# Altium schematic sheet DAC.SchDoc: My title
size A3; Organization: University of California; Address1: 475 Portola Plaza; Address2: Los Angeles, CA 90095; Revision: R01; SheetNumber: 1; SheetTotal: 1
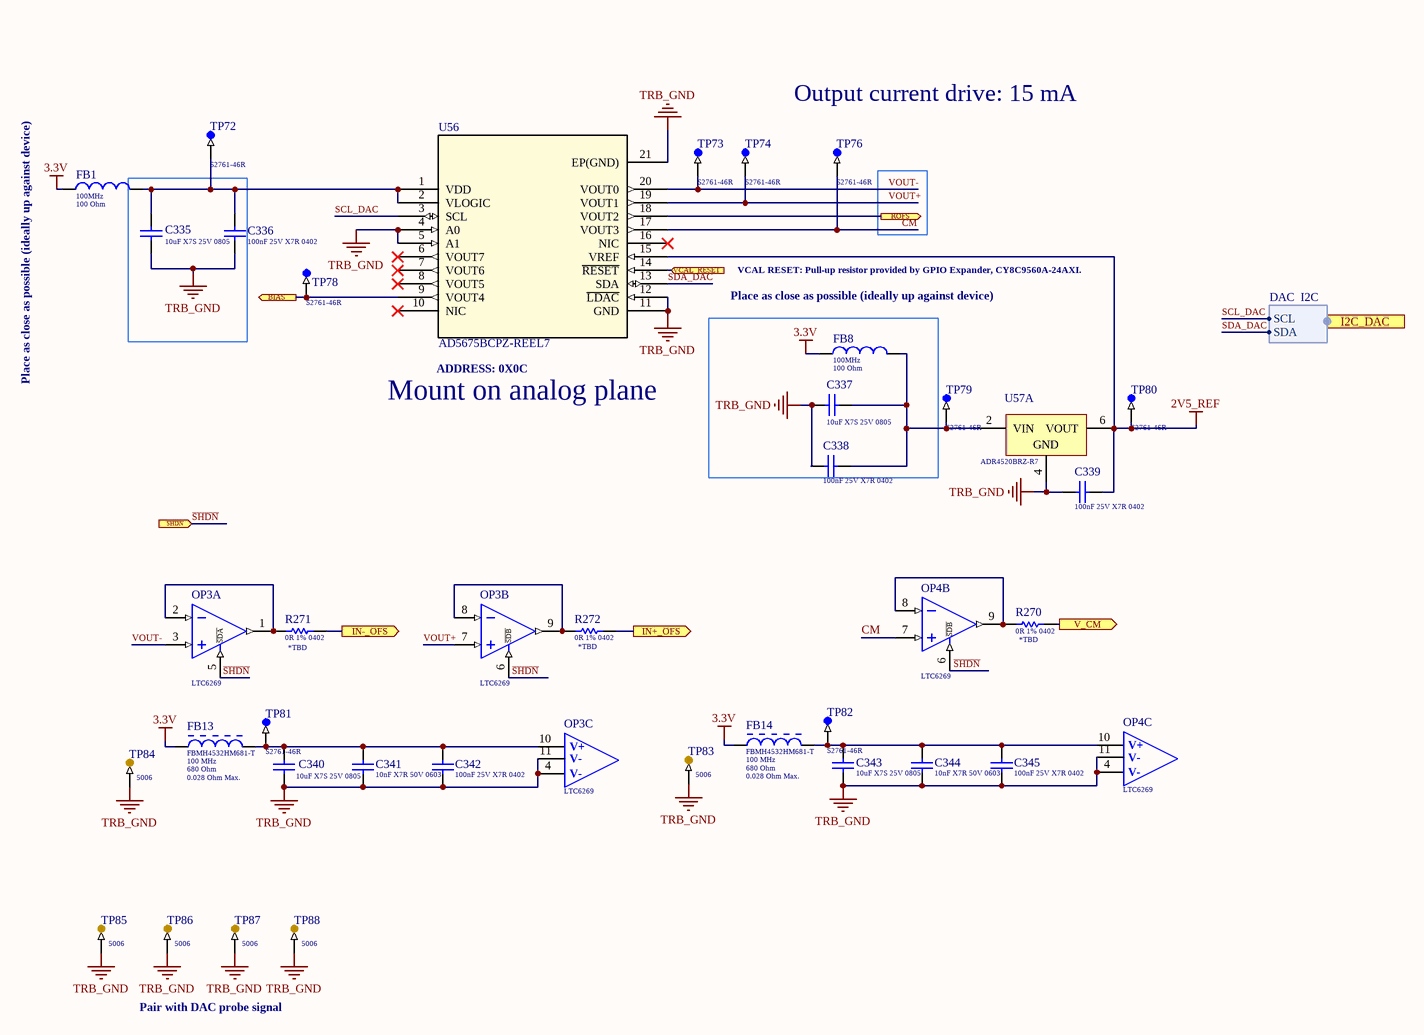
[diagram p0: DAC.SchDoc]

## Parts
C335  Capacitance: 10uF X7S 25V 0805  [Cap_Murata_ GRM21BC71E106ME11L_10uF]  (hidden comment: Cap_Murata_ GRM21BC71E106ME11L_10uF)
C336  Capacitance: 100nF 25V X7R 0402  [Cap_Taiyo_Yuden_TMK105B7104KV-FR_100nF]  (hidden comment: Cap_Taiyo_Yuden_TMK105B7104KV-FR_100nF)
C337  Capacitance: 10uF X7S 25V 0805  [Cap_Murata_ GRM21BC71E106ME11L_10uF]  (hidden comment: Cap_Murata_ GRM21BC71E106ME11L_10uF)
C338  Capacitance: 100nF 25V X7R 0402  [Cap_Taiyo_Yuden_TMK105B7104KV-FR_100nF]  (hidden comment: Cap_Taiyo_Yuden_TMK105B7104KV-FR_100nF)
C339  Capacitance: 100nF 25V X7R 0402  [Cap_Taiyo_Yuden_TMK105B7104KV-FR_100nF]  (hidden comment: Cap_Taiyo_Yuden_TMK105B7104KV-FR_100nF)
C340  Capacitance: 10uF X7S 25V 0805  [Cap_Murata_ GRM21BC71E106ME11L_10uF]  (hidden comment: Cap_Murata_ GRM21BC71E106ME11L_10uF)
C341  Capacitance: 10nF X7R 50V 0603  [Kemet_C0603_0]  (hidden comment: Cap_Kemet_C0603C103J5RACTU_eec)
C342  Capacitance: 100nF 25V X7R 0402  [Cap_Taiyo_Yuden_TMK105B7104KV-FR_100nF]  (hidden comment: Cap_Taiyo_Yuden_TMK105B7104KV-FR_100nF)
C343  Capacitance: 10uF X7S 25V 0805  [Cap_Murata_ GRM21BC71E106ME11L_10uF]  (hidden comment: Cap_Murata_ GRM21BC71E106ME11L_10uF)
C344  Capacitance: 10nF X7R 50V 0603  [Kemet_C0603_0]  (hidden comment: Cap_Kemet_C0603C103J5RACTU_eec)
C345  Capacitance: 100nF 25V X7R 0402  [Cap_Taiyo_Yuden_TMK105B7104KV-FR_100nF]  (hidden comment: Cap_Taiyo_Yuden_TMK105B7104KV-FR_100nF)
FB1  Measuring Frequency: 100MHz  Impedance: 100 Ohm  [FB_Wurth_Electronics_742792731_100Ohms]  (hidden comment: 742792731)
FB8  Measuring Frequency: 100MHz  Impedance: 100 Ohm  [FB_Wurth_Electronics_742792731_100Ohms]  (hidden comment: 742792731)
FB13  Measuring Frequency: 100 MHz  Nominal Impedance: 680 Ohm  DC Resistance: 0.028 Ohm Max.  [TAYO-FBMH4532-2_V]  (hidden comment: FBMH4532HM681-T)
FB14  Measuring Frequency: 100 MHz  Nominal Impedance: 680 Ohm  DC Resistance: 0.028 Ohm Max.  [TAYO-FBMH4532-2_V]  (hidden comment: FBMH4532HM681-T)
OP3  Series: LTC6269  [OpAmp_Linear_Technology_ LTC6269HDD#PBF_500Mhz]  (hidden comment: OpAmp_Linear_Technology_ LTC6269HDD#PBF_500Mhz)  (parts A,B,C of 3)
OP4  Series: LTC6269  [OpAmp_Linear_Technology_ LTC6269HDD#PBF_500Mhz]  (hidden comment: OpAmp_Linear_Technology_ LTC6269HDD#PBF_500Mhz)  (parts B,C of 3)
R270  Resistance: 0R 1% 0402  [Res_Vishay_CRCW04020000Z0EDC_0_Ohm]  (hidden comment: Res_Vishay_CRCW04020000Z0EDC_0_Ohm)
R271  Resistance: 0R 1% 0402  [Res_Vishay_CRCW04020000Z0EDC_0_Ohm]  (hidden comment: Res_Vishay_CRCW04020000Z0EDC_0_Ohm)
R272  Resistance: 0R 1% 0402  [Res_Vishay_CRCW04020000Z0EDC_0_Ohm]  (hidden comment: Res_Vishay_CRCW04020000Z0EDC_0_Ohm)
TP72  Series: S2761-46R  [TP_Harwin_S2761_46R]  (hidden comment: TP_Harwin_S2761_46R)
TP73  Series: S2761-46R  [TP_Harwin_S2761_46R]  (hidden comment: TP_Harwin_S2761_46R)
TP74  Series: S2761-46R  [TP_Harwin_S2761_46R]  (hidden comment: TP_Harwin_S2761_46R)
TP76  Series: S2761-46R  [TP_Harwin_S2761_46R]  (hidden comment: TP_Harwin_S2761_46R)
TP78  Series: S2761-46R  [TP_Harwin_S2761_46R]  (hidden comment: TP_Harwin_S2761_46R)
TP79  Series: S2761-46R  [TP_Harwin_S2761_46R]  (hidden comment: TP_Harwin_S2761_46R)
TP80  Series: S2761-46R  [TP_Harwin_S2761_46R]  (hidden comment: TP_Harwin_S2761_46R)
TP81  Series: S2761-46R  [TP_Harwin_S2761_46R]  (hidden comment: TP_Harwin_S2761_46R)
TP82  Series: S2761-46R  [TP_Harwin_S2761_46R]  (hidden comment: TP_Harwin_S2761_46R)
TP83  Series: 5006  [TP_Keystone_Electronics_5006]  (hidden comment: TP_Keystone_Electronics_5006)
TP84  Series: 5006  [TP_Keystone_Electronics_5006]  (hidden comment: TP_Keystone_Electronics_5006)
TP85  Series: 5006  [TP_Keystone_Electronics_5006]  (hidden comment: TP_Keystone_Electronics_5006)
TP86  Series: 5006  [TP_Keystone_Electronics_5006]  (hidden comment: TP_Keystone_Electronics_5006)
TP87  Series: 5006  [TP_Keystone_Electronics_5006]  (hidden comment: TP_Keystone_Electronics_5006)
TP88  Series: 5006  [TP_Keystone_Electronics_5006]  (hidden comment: TP_Keystone_Electronics_5006)
U56  AD5675  [CP_20_8]  (value not drawn)
U57  ADR4520BRZ-R7  [ADI-R-8_M]  (part A of 2)

## Blocks framed on the sheet
Place as close as possible (ideally up against device): C337 C338 FB8

## Ports
BIAS (out), I2C_DAC (harness DAC  I2C), IN+_OFS (out), IN-_OFS (out), ROFS (out), V_CM (out), VCAL_RESET (in), ~{SHDN} (in)

## Harnesses
DAC  I2C: SCL, SDA

## Nets
2V5_REF: C339.2 TP80.1 U56.15(VREF) U57.6(VOUT)
3.3V: FB1.1 FB8.1 FB13.1 FB14.1
TRB_GND: C335.2 C336.1 C337.2 C338.1 C339.1 C340.2 C341.2 C342.1 C343.2 C344.2 C345.1 OP3.4(V-) OP3.11(V-) OP4.4(V-) OP4.11(V-) TP83.1 TP84.1 TP85.1 TP86.1 TP87.1 TP88.1 U56.4(A0) U56.5(A1) U56.11(GND) U56.12(~{LDAC}) U56.21(EP(GND)) U57.4(GND)
BIAS: TP78.1 U56.9(VOUT4) ; port BIAS
CM: OP4.7(IN_A+) TP76.1 U56.17(VOUT3)
IN+_OFS: R272.2 ; port IN+_OFS
IN-_OFS: R271.2 ; port IN-_OFS
ROFS: U56.18(VOUT2) ; port ROFS
~{SHDN}: OP3.5(~{SDA}) OP3.6(~{SDB}) OP4.6(~{SDB}) ; port ~{SHDN}
SCL_DAC: U56.3(SCL) ; port I2C_DAC.SCL
SDA_DAC: U56.13(SDA) ; port I2C_DAC.SDA
V_CM: R270.2 ; port V_CM
VCAL_RESET: U56.14(~{RESET}) ; port VCAL_RESET
VOUT+: OP3.7(IN_A+) TP74.1 U56.19(VOUT1)
VOUT-: OP3.3(IN_A+) TP73.1 U56.20(VOUT0)
NetC335_1: C335.1 C336.2 FB1.2 TP72.1 U56.1(VDD) U56.2(VLOGIC)
NetC337_1: C337.1 C338.2 FB8.2 TP79.1 U57.2(VIN)
NetC340_1: C340.1 C341.1 C342.2 FB13.2 OP3.10(V+) TP81.1
NetC343_1: C343.1 C344.1 C345.2 FB14.2 OP4.10(V+) TP82.1
NetOP3_1: OP3.1(OUT_A) OP3.2(IN_A-) R271.1
NetOP3_8: OP3.8(IN_A-) OP3.9(OUT_A) R272.1
NetOP4_8: OP4.8(IN_A-) OP4.9(OUT_A) R270.1

Not connected (* = marked no-connect by the designer): U56 6(VOUT7)* 7(VOUT6)* 8(VOUT5)* 10(NIC)* 16(NIC)*

## Notes on the sheet
- Output current drive: 15 mA
- VCAL RESET: Pull-up resistor provided by GPIO Expander, CY8C9560A-24AXI.
- (near FB1) Place as close as possible (ideally up against device)
- Mount on analog plane
- (near U56) ADDRESS: 0X0C
- (near R271) *TBD
- (near R272) *TBD
- (near R270) *TBD
- Pair with DAC probe signal
- 475 Portola Plaza
- GAPS TOF
- igarcia91@g.ucla.edu
- Los Angeles, CA
- 310-825-0344
- Size:
- Date:
- Letter
- Number:
- Time:
- Sheet
- Revision:
- of
- andrew.peck@cern.ch
- spq@ucla.edu
- File:

## Library data of the parts
C335 C337 C340 C343 = Cap_Murata_ GRM21BC71E106ME11L_10uF: CAP CER 10uF 25V X7R 0805; Supplier 1: Mouser; Supplier Part Number 1: 81-GRM21BC71E106ME1L
C336 C338 C339 C342 C345 = Cap_Taiyo_Yuden_TMK105B7104KV-FR_100nF: CAP CER 100nF 25V X7R 0402; Supplier 1: Mouser; Supplier Part Number 1: 963-TMK105B7104KV-FR
C341 C344 = Cap_Kemet_C0603C103J5RACTU_eec: CAP CER 10nF 50V X7R 0603; Manufacturer: Kemet; Mfg Package Ident: C0603; Part Number: C0603C103J5RACTU; helpURL: https://upverter.com/upn/revision/8a8d0c297e33ac74/; ComponentLink2Description: Datasheet; Temperature: -55°C to +125°C; Package: C0603; Supplier 2: Mouser; Price: 0.0184203126773; Supplier 1: Digi-Key; ComponentLink1URL: https://upverter.com/upn/revision/8a8d0c297e33ac74/; Supplier Part Number 2: 80-C0603C103J5R; Supplier Part Number 1: 399-1092-1-ND; Value: 10nF; ComponentLink1Description: Upverter; ComponentLink2URL: https://content.kemet.com/datasheets/KEM_C1002_X7R_SMD.pdf; RoHS: TRUE; Mouser Part Number: 80-C0603C103J5R; Temperature Range High: +125°C; Digikey Description: CAP CER 10000PF 50V X7R 0603; Digikey Part Number: 399-1092-1-ND; Lead Free: yes; Temperature Range Low: -55°C; Voltage: 50V
FB1 FB8 = FB_Wurth_Electronics_742792731_100Ohms: FB SMD 100 OHM 25% 1.2A 0402; DC Resistance: 90mOhm; Supplier 1: Mouser; Supplier Part Number 1: 710-742792731
FB13 FB14 = FBMH4532HM681-T: Chip Bead Inductor for Power Lines, 680 Ohm, 4 A, -40 to 125 degC, 2-Pin 4.5 x 3.2 x 3.5 mm SMD, RoHS, Taping; Manufacturer: Taiyo Yuden; Rated Current: 4 A Max.; Impedance Tolerance: +/- 25%; ComponentLink1Description: Manufacturer URL; ComponentLink2Description: Datasheet; DatasheetVersion: 09/2014; ComponentLink3URL: http://www.yuden.co.jp/productdata/catalog/en/chipbeads01_e.pdf; ComponentLink3Description: Package Specification; ComponentLink1URL: http://www.t-yuden.com/; Mounting Technology: Surface Mount; Packing: Taping; Temperature Range: -40 to 125 degC; PartNumber: FBMH4532HM681-T; PackageDescription: 2-Pin Surface Mount Device, Body 4.5 x 3.2 mm, Height 3.5 mm; ComponentLink2URL: http://www.yuden.co.jp/productdata/catalog/en/chipbeads01_e.pdf; RoHS: TRUE; Supplier 1: Digi-Key; Supplier Part Number 1: 587-1761-6-ND
OP3 OP4 = OpAmp_Linear_Technology_ LTC6269HDD#PBF_500Mhz: IC OPAMP 500MHZ DUAL FET 10DFN; Supplier 1: Digi-Key; Supplier Part Number 1: LTC6269HDD#PBF-ND
R270-R272 = Res_Vishay_CRCW04020000Z0EDC_0_Ohm: 0R 0.062W 1% 0402 (1005 Metric)  SMD; Supplier 1: Mouser; Supplier Part Number 1: 71-CRCW04020000Z0EDC
TP72-TP74 TP76 TP78-TP82 = TP_Harwin_S2761_46R: Circuit Board Hardware - PCB SMT Mini Test Terminal, Reel; Supplier 1: Newark; Supplier Part Number 1: 76Y5391
TP83-TP88 = TP_Keystone_Electronics_5006: Circuit Board Hardware - PCB TEST POINT BLK .063; Supplier 1: Mouser; Supplier Part Number 1: 534-5006
U56 = AD5675BCPZ-REEL7: Digital to Analog Converters - DAC 16-bit octal I2C nanoDAC; Vendor: Analog Devices Inc; Built_By: Analog Devices Inc.; Manufacturer_Part_Number: AD5675BCPZ-REEL7; RefDes: RefDes; Type: DEV; Value: Value; Supplier Part Number 1: 584-AD5675BCPZ-REEL7; Supplier 1: Mouser; Series: AD5675BCPZ-REEL7
U57 = CMP-0784-00295-1: Ultralow Noise, High Accuracy Voltage Reference, 2.048 V Output, 3 to 15 V Supply, Industrial, 8-pin SOIC (R-8), Reel; Manufacturer: Analog Devices; Min V Supply (V): 3; Vout: 2.048V; Max V Supply (V): 15; Ref Out TC (ppm/C): 2; ComponentLink3Description: Package Specification; Packing: Reel; ComponentLink1URL: http://www.analog.com/en/index.html; ComponentLink3URL: http://www.analog.com/static/imported-files/packages/PKG_PDF/SOIC_Narrow%20(R)/R_8.pdf; ComponentLink2URL: http://www.analog.com/static/imported-files/data_sheets/ADR4520_4525_4530_4533_4540_4550.pdf; ComponentLink2Description: Datasheet; PartNumber: ADR4520BRZ-R7; ComponentLink1Description: Manufacturer URL; PackageVersion: 060506-A, 06/2006; Operating Temp Range: -40 to 125 degC; ComponentLink4URL: Product URL:http://www.analog.com/en/special-linear-functions/voltage-references/adr4520/products/product.html; PackageReference: R-8; Code_JEDEC: MS-012-AA; Mounting Technology: Surface Mount; DatasheetVersion: Rev. 0; ComponentLink4Description: URL Link1; PackageDescription: 8-Pin Standard Small Outline Package, Body 4.9 x 3.9 mm, Pitch 1.27 mm